# EAGLE design IN-17 logic V1.0 (EAGLE 9.6.2)
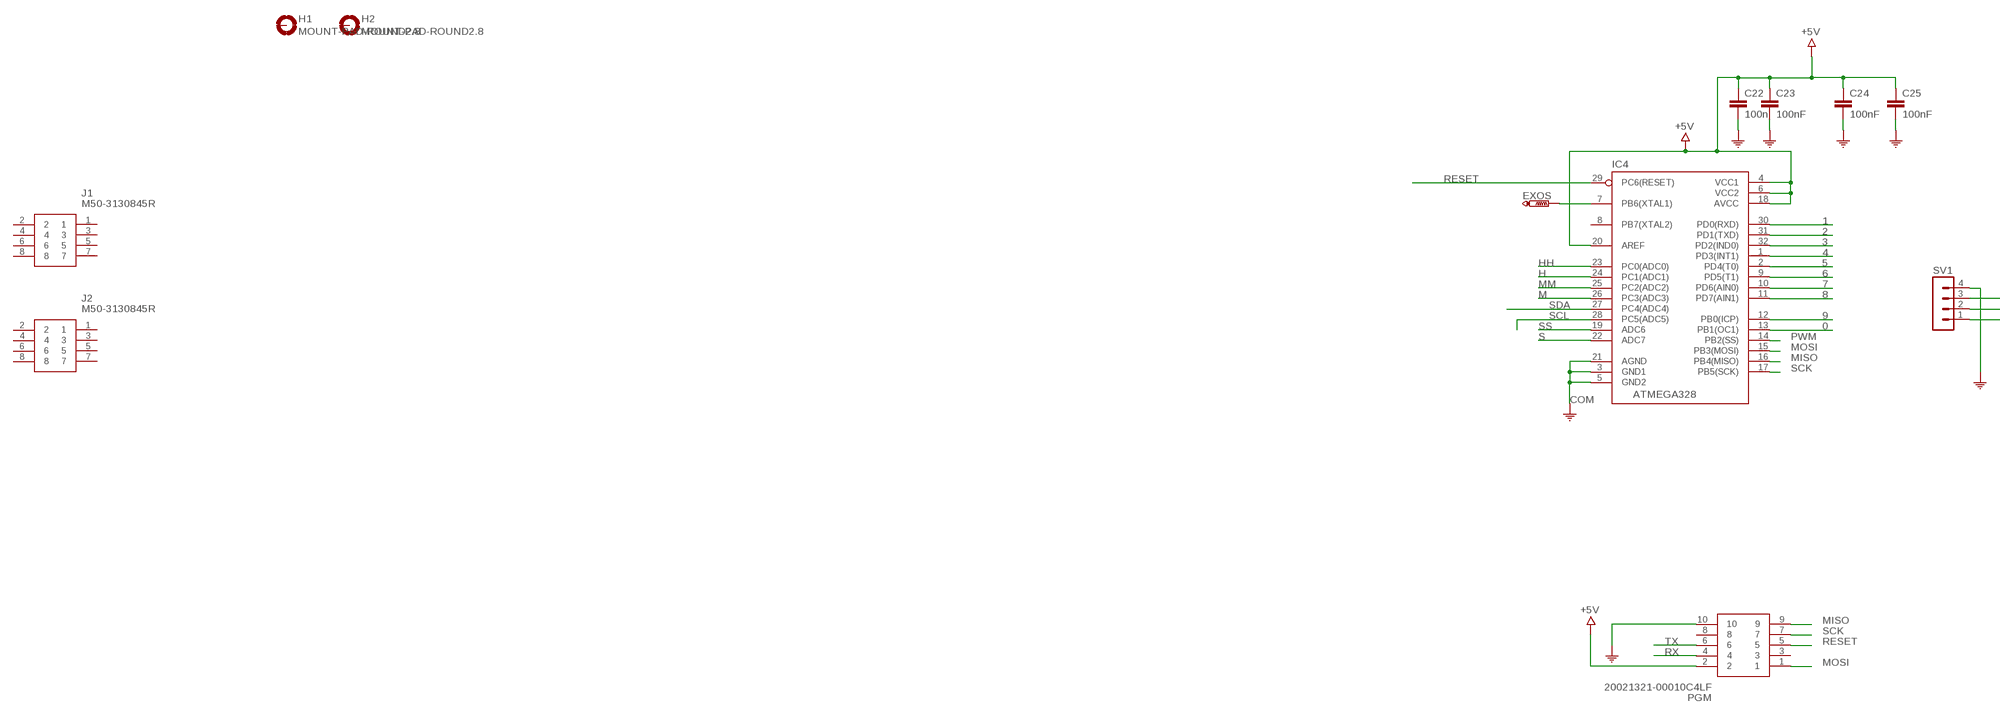
[diagram p0: schematic, sheet 1, part 1 of 2]
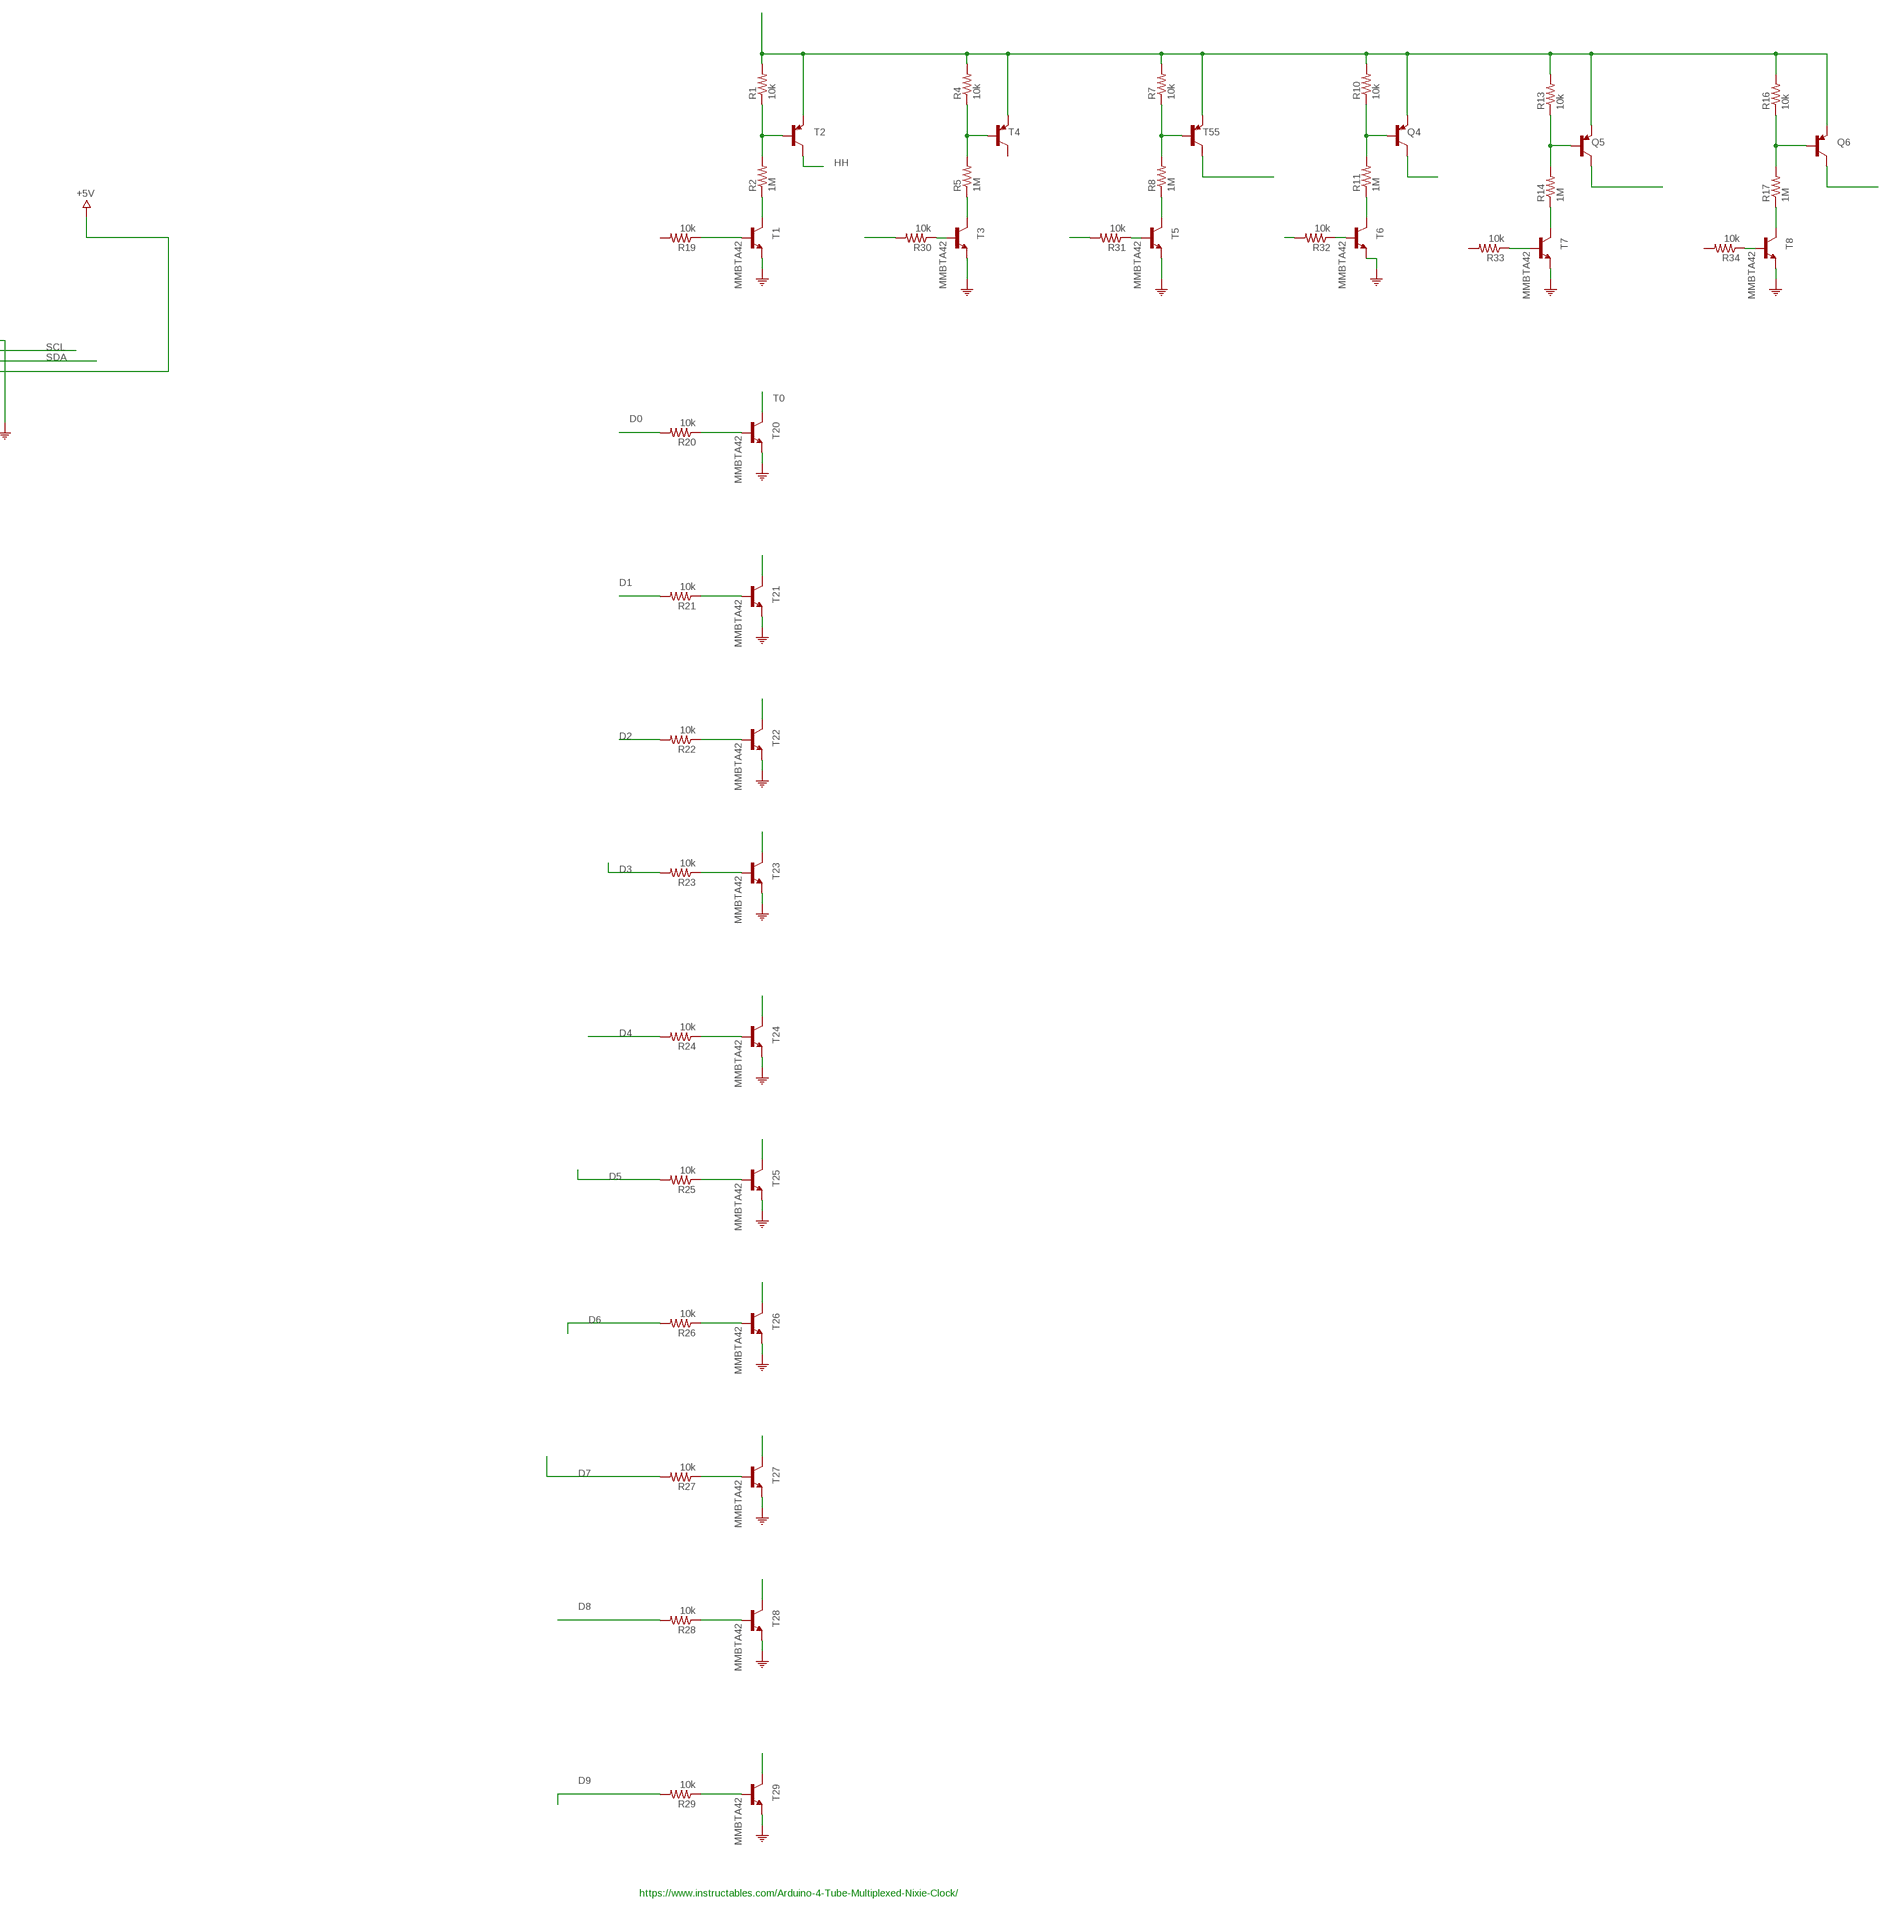
[diagram p1: schematic, sheet 1, part 2 of 2]

## Parts
C22  100n  C-EUC0805  [C0805]
C23  100nF  C-EUC0805  [C0805]
C24  100nF  C-EUC0805  [C0805]
C25  100nF  C-EUC0805  [C0805]
EXOS  PTR1TP09R  [TP09R]
H1  MOUNT-PAD-ROUND2.8  [2,8-PAD]
H2  MOUNT-PAD-ROUND2.8  [2,8-PAD]
IC4  ATMEGA328  ATMEGA168-20AU  [QFP032]
J1  M50-3130845R  [M503130845R]
J2  M50-3130845R  [M503130845R]
PGM  20021321-00010C4LF  [2002132100010C4LF]
Q4  TRANSISTOR_BJT_PNP-SOT-23-BCE  [SOT-23]
Q5  TRANSISTOR_BJT_PNP-SOT-23-BCE  [SOT-23]
Q6  TRANSISTOR_BJT_PNP-SOT-23-BCE  [SOT-23]
R1  10k  R-US_R0805  [R0805]
R2  1M  R-US_R0805  [R0805]
R4  10k  R-US_R0805  [R0805]
R5  1M  R-US_R0805  [R0805]
R7  10k  R-US_R0805  [R0805]
R8  1M  R-US_R0805  [R0805]
R10  10k  R-US_R0805  [R0805]
R11  1M  R-US_R0805  [R0805]
R13  10k  R-US_R0805  [R0805]
R14  1M  R-US_R0805  [R0805]
R16  10k  R-US_R0805  [R0805]
R17  1M  R-US_R0805  [R0805]
R19  10k  R-US_R0805  [R0805]
R20  10k  R-US_R0805  [R0805]
R21  10k  R-US_R0805  [R0805]
R22  10k  R-US_R0805  [R0805]
R23  10k  R-US_R0805  [R0805]
R24  10k  R-US_R0805  [R0805]
R25  10k  R-US_R0805  [R0805]
R26  10k  R-US_R0805  [R0805]
R27  10k  R-US_R0805  [R0805]
R28  10k  R-US_R0805  [R0805]
R29  10k  R-US_R0805  [R0805]
R30  10k  R-US_R0805  [R0805]
R31  10k  R-US_R0805  [R0805]
R32  10k  R-US_R0805  [R0805]
R33  10k  R-US_R0805  [R0805]
R34  10k  R-US_R0805  [R0805]
SV1  MA04-1  [MA04-1]
T1  MMBTA42  BC846  [SOT23]
T2  TRANSISTOR_BJT_PNP-SOT-23-BCE  [SOT-23]
T3  MMBTA42  BC846  [SOT23]
T4  TRANSISTOR_BJT_PNP-SOT-23-BCE  [SOT-23]
T5  MMBTA42  BC846  [SOT23]
T6  MMBTA42  BC846  [SOT23]
T7  MMBTA42  BC846  [SOT23]
T8  MMBTA42  BC846  [SOT23]
T20  MMBTA42  BC846  [SOT23]
T21  MMBTA42  BC846  [SOT23]
T22  MMBTA42  BC846  [SOT23]
T23  MMBTA42  BC846  [SOT23]
T24  MMBTA42  BC846  [SOT23]
T25  MMBTA42  BC846  [SOT23]
T26  MMBTA42  BC846  [SOT23]
T27  MMBTA42  BC846  [SOT23]
T28  MMBTA42  BC846  [SOT23]
T29  MMBTA42  BC846  [SOT23]
T55  TRANSISTOR_BJT_PNP-SOT-23-BCE  [SOT-23]

## Nets
0: IC4.13(PB1(OC1))
1: IC4.30(PD0(RXD))
2: IC4.31(PD1(TXD))
3: IC4.32(PD2(IND0))
4: IC4.1(PD3(INT1))
5: IC4.2(PD4(T0))
6: IC4.9(PD5(T1))
7: IC4.10(PD6(AIN0))
8: IC4.11(PD7(AIN1))
9: IC4.12(PB0(ICP))
+5V [pwr]: C22.1 C23.1 C24.1 C25.1 IC4.4(VCC1) IC4.6(VCC2) IC4.18(AVCC) IC4.20(AREF) PGM.2 SV1.1
COM: C22.2 C23.2 C24.2 C25.2 IC4.3(GND1) IC4.5(GND2) IC4.21(AGND) PGM.10 SV1.4 T1.2(E) T3.2(E) T5.2(E) T6.2(E) T7.2(E) T8.2(E) T20.2(E) T21.2(E) T22.2(E) T23.2(E) T24.2(E) T25.2(E) T26.2(E) T27.2(E) T28.2(E) T29.2(E)
D0: R20.2
D1: R21.2
D2: R22.2
D3: R23.2
D4: R24.2
D5: R25.2
D6: R26.2
D7: R27.2
D8: R28.2
D9: R29.2
H: IC4.24(PC1(ADC1))
HH: IC4.23(PC0(ADC0)) T2.2(C)
M: IC4.26(PC3(ADC3))
MISO: IC4.16(PB4(MISO)) PGM.9
MM: IC4.25(PC2(ADC2))
MOSI: IC4.15(PB3(MOSI)) PGM.1
N$1: R1.1 R2.2 T2.1(B)
N$2: R2.1 T1.3(C)
N$3: Q6.2(C)
N$4: Q4.3(E) Q5.3(E) Q6.3(E) R1.2 R4.2 R7.2 R10.2 R13.2 R16.2 T2.3(E) T4.3(E) T55.3(E)
N$5: EXOS.TP IC4.7(PB6(XTAL1))
N$6: R19.1 T1.1(B)
N$8: R20.1 T20.1(B)
N$9: T21.3(C)
N$10: R21.1 T21.1(B)
N$11: T22.3(C)
N$12: R22.1 T22.1(B)
N$13: T23.3(C)
N$14: R23.1 T23.1(B)
N$15: T24.3(C)
N$16: R24.1 T24.1(B)
N$17: T25.3(C)
N$18: R25.1 T25.1(B)
N$19: T26.3(C)
N$20: R26.1 T26.1(B)
N$21: T27.3(C)
N$22: R27.1 T27.1(B)
N$23: T28.3(C)
N$24: R28.1 T28.1(B)
N$25: T29.3(C)
N$26: R29.1 T29.1(B)
N$27: Q5.2(C)
N$28: Q4.2(C)
N$29: T55.2(C)
N$31: Q5.1(B) R13.1 R14.2
N$32: Q4.1(B) R10.1 R11.2
N$33: R7.1 R8.2 T55.1(B)
N$34: R4.1 R5.2 T4.1(B)
N$35: R5.1 T3.3(C)
N$36: R8.1 T5.3(C)
N$37: R11.1 T6.3(C)
N$38: R14.1 T7.3(C)
N$39: Q6.1(B) R16.1 R17.2
N$41: R17.1 T8.3(C)
N$42: R34.1 T8.1(B)
N$43: R33.1 T7.1(B)
N$44: R32.1 T6.1(B)
N$45: R31.1 T5.1(B)
N$46: R30.1 T3.1(B)
N$47: R30.2
N$48: R31.2
N$49: R32.2
PWM: IC4.14(PB2(SS))
RESET: IC4.29(PC6(RESET)) PGM.5
RX: PGM.4
S: IC4.22(ADC7)
SCK: IC4.17(PB5(SCK)) PGM.7
SCL: IC4.28(PC5(ADC5)) SV1.3
SDA: IC4.27(PC4(ADC4)) SV1.2
SS: IC4.19(ADC6)
T0: T20.3(C)
TX: PGM.6
Unconnected: H1.B2,8(MOUNT) H2.B2,8(MOUNT) IC4.8(PB7(XTAL2)) J1.1 J1.2 J1.3 J1.4 J1.5 J1.6 J1.7 J1.8 J2.1 J2.2 J2.3 J2.4 J2.5 J2.6 J2.7 J2.8 PGM.3 PGM.8 R19.2 R33.2 R34.2 T4.2(C)

## Notes on the sheet
- https://www.instructables.com/Arduino-4-Tube-Multiplexed-Nixie-Clock/

## Library data of the parts
C22-C25 = rcl:C-EU: CAPACITOR, European symbol; SPICEPREFIX: C
EXOS = testpad:PTR1: TEST PIN
H1 H2 = holes:MOUNT-PAD-ROUND: MOUNTING PAD, round
IC4 = MySMD:ATMEGA168-20AU; PU: 1.40
J1 J2 = SamacSys_Parts:M50-3130845R: Headers & Wire Housings 8 WAY SIL L/P D/E SMT SKT T&R Source: Datasheet <https://cdn.harwin.com/pdfs/M50-313.pdf>; DESCRIPTION: Headers & Wire Housings 8 WAY SIL L/P D/E SMT SKT T&R; HEIGHT: 2.15mm; MANUFACTURER_NAME: Harwin; MANUFACTURER_PART_NUMBER: M50-3130845R; MOUSER_PART_NUMBER: 855-M50-3130845R; MOUSER_PRICE-STOCK: https://www.mouser.co.uk/ProductDetail/Harwin/M50-3130845R?qs=%252BdQmOuGyFcEPvrxbacvJZw%3D%3D
PGM = SamacSys_Parts:20021321-00010C4LF: Headers & Wire Housings 1.27x1.27mm BTB, Hdr Recept, SMT, 10 Pos Source: Datasheet <https://componentsearchengine.com/Datasheets/1/20021321-00010C4LF.pdf>; DESCRIPTION: Headers & Wire Housings 1.27x1.27mm BTB, Hdr Recept, SMT, 10 Pos; HEIGHT: 4.75mm; MANUFACTURER_NAME: Amphenol; MANUFACTURER_PART_NUMBER: 20021321-00010C4LF; MOUSER_PART_NUMBER: 649-202132100010C4LF; MOUSER_PRICE-STOCK: https://www.mouser.com/Search/Refine.aspx?Keyword=649-202132100010C4LF
Q4-Q6 T2 T4 T55 = dp_devices:TRANSISTOR_BJT_PNP: Most commonly used is SOT23-BEC
R1 R2 R4 R5 R7 R8 R10 R11 R13 R14 R16 R17 R19-R34 = adafruit:R-US_: RESISTOR, American symbol
SV1 = con-lstb:MA04-1: PIN HEADER; OC_FARNELL: unknown; OC_NEWARK: unknown
T1 T3 T5-T8 T20-T29 = transistor:BC846: NPN TRANSISTOR

## Net classes
1 pwr: width 0.254 mm, clearance 0.356 mm

## Board
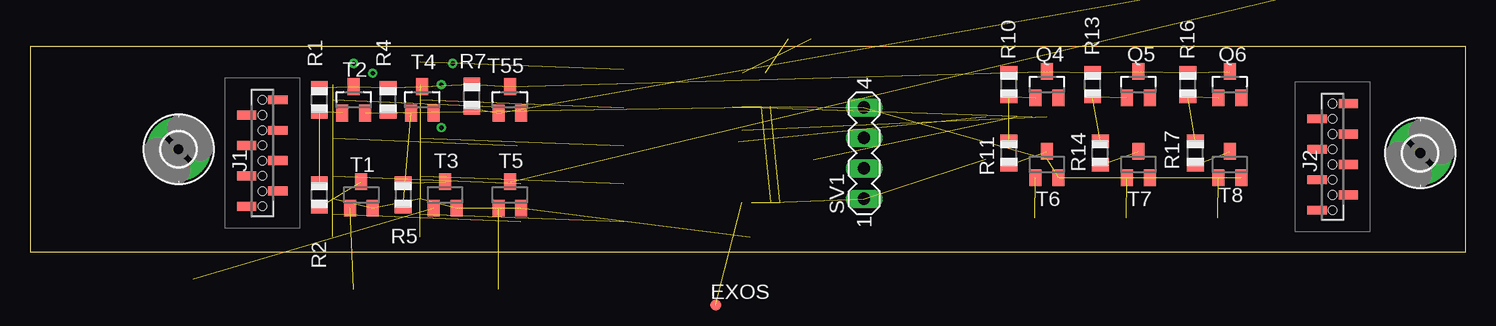
[diagram p2: board, top side]
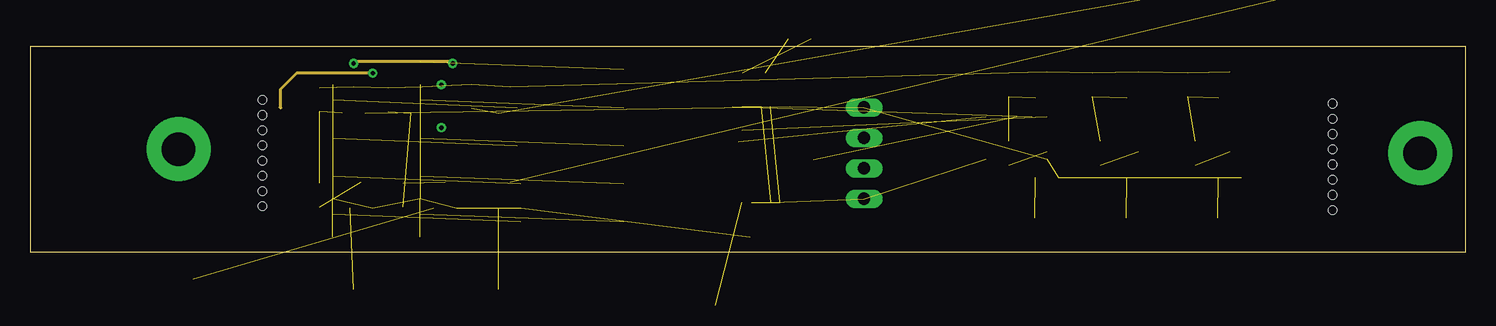
[diagram p3: board, inner layer Route2]
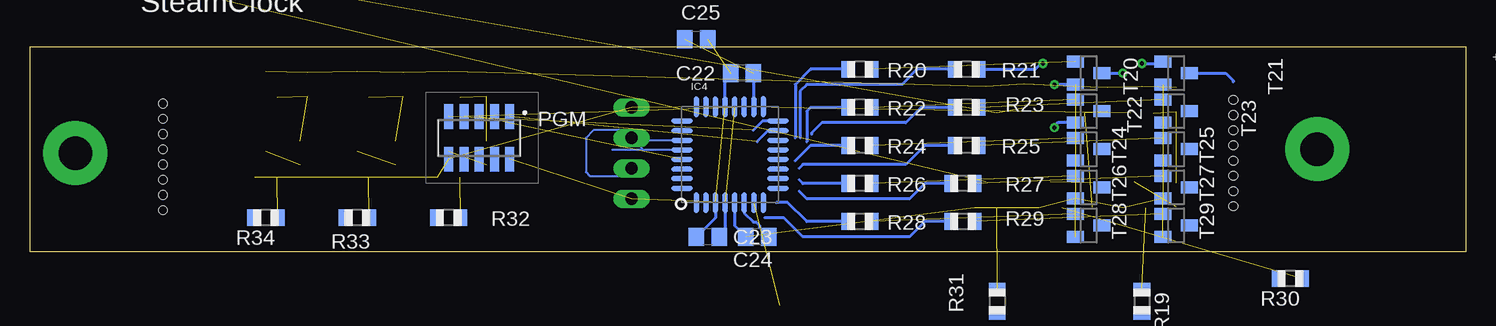
[diagram p4: board, bottom side, seen from below]

Size 119.68 x 17.13 mm. Coordinates in mm from the lower left corner, seen from the top.
Outline: 0,0 119.68,0 119.68,17.13 0,17.13 0,0
Copper layers (1+2*15+16): Top 0.035mm / dielectric 1.5mm / Route2 0.035mm / dielectric 0.15mm / GND 0.035mm / dielectric 0.2mm / Bottom 0.035mm
Design rules "default *": minimum track width 6mil, minimum drill 0.35mm, track to track 6mil, track to pad 6mil, pad to pad 6mil, via to via 6mil, smd to smd 6mil, copper to edge 40mil, drill to drill 6mil, minimum pad ring 10mil, minimum via ring 8mil, stop-mask expansion 4mil, vias tented up to drill 0mil, thermal gap 10mil

### Footprints (pad centres in the part's own frame; a part is rotated, then mirrored left to right if it is on the bottom)
C0805 = smd 1.3 x 1.5: 1 -0.95,0; 2 0.95,0
TP09R = smd 0.9 x 0.9: TP 0,0
2,8-PAD = drill 2.8 pad 5.334: B2,8 0,0
QFP032 = smd 0.432 x 1.778: 1 0,0; 2 0.8,0; 3 1.599,0; 4 2.399,0; 5 3.199,0; 6 3.998,0; 7 4.798,0; 8 5.598,0; 17 5.588,8.001; 18 4.798,7.997; 19 3.998,7.997; 20 3.199,7.997; 21 2.399,7.997; 22 1.599,7.997; 23 0.799,7.997; 24 0,7.997 | smd 1.778 x 0.432: 9 6.807,1.194; 10 6.807,2.007; 11 6.807,2.794; 12 6.807,3.607; 13 6.807,4.394; 14 6.807,5.182; 15 6.807,5.994; 16 6.816,6.803; 25 -1.194,6.807; 26 -1.194,5.994; 27 -1.194,5.182; 28 -1.194,4.394; 29 -1.194,3.607; 30 -1.194,2.794; 31 -1.194,2.007; 32 -1.194,1.194
M503130845R = smd 0.74 x 1.6: 1 -4.445,1.3; 2 -3.175,-1.3; 3 -1.905,1.3; 4 -0.635,-1.3; 5 0.635,1.3; 6 1.905,-1.3; 7 3.175,1.3; 8 4.445,-1.3 | hole 0.7: -4.445,0; -3.175,0; -1.905,0; -0.635,0; 0.635,0; 1.905,0; 3.175,0; 4.445,0
2002132100010C4LF = smd 0.76 x 2.05: 1 2.54,1.775; 2 2.54,-1.775; 3 1.27,1.775; 4 1.27,-1.775; 5 0,1.775; 6 0,-1.775; 7 -1.27,1.775; 8 -1.27,-1.775; 9 -2.54,1.775; 10 -2.54,-1.775
SOT-23 = smd 1 x 1.4: 1 -0.95,-1.1; 2 0.95,-1.1; 3 0,1.1
R0805 = smd 1.1 x 1.4: 1 -1,0; 2 1,0
MA04-1 = drill 1.016 long: 1 -3.81,0; 2 -1.27,0; 3 1.27,0; 4 3.81,0
SOT23 = smd 1 x 1.4: 1 -0.95,-1.1; 2 0.95,-1.1; 3 0,1.1

### Placement (x,y rotation side)
C22  60.32,14.92 180 bottom
C23  63.18,1.27 180 bottom
C24  59.05,1.27 180 bottom
C25  64.14,17.78 0 bottom
EXOS  57.15,-4.45 0 top  (outside the outline)
H1  12.38,8.57 0 top
H2  115.89,8.25 0 top
IC4  64.14,4.13 0 bottom
J1  19.37,8.25 90 top
J2  108.59,7.94 90 top
PGM  82.23,9.52 0 bottom
Q4  84.77,13.97 0 top
Q5  92.39,13.97 0 top
Q6  100.01,13.97 0 top
R1  24.13,12.7 90 top
R2  24.13,4.76 90 top
R4  29.84,12.7 90 top
R5  31.11,4.76 270 top
R7  36.83,13.02 90 top
R8  142.88,30.16 0 top  (outside the outline)
R10  81.6,13.97 90 top
R11  81.6,8.25 90 top
R13  88.58,13.97 90 top
R14  89.22,8.25 90 top
R16  96.52,13.97 90 top
R17  97.16,8.25 90 top
R19  26.99,-4.13 270 bottom  (outside the outline)
R20  50.48,15.24 180 bottom
R21  41.59,15.24 180 bottom
R22  50.48,12.06 180 bottom
R23  41.59,12.06 180 bottom
R24  50.48,8.89 180 bottom
R25  41.59,8.89 180 bottom
R26  50.48,5.71 180 bottom
R27  41.91,5.71 180 bottom
R28  50.48,2.54 180 bottom
R29  41.91,2.54 180 bottom
R30  14.61,-2.22 180 bottom
R31  39.05,-4.13 270 bottom  (outside the outline)
R32  84.77,2.86 180 bottom
R33  92.39,2.86 180 bottom
R34  100.01,2.86 180 bottom
SV1  69.53,8.25 90 top
T1  27.62,4.76 0 top
T2  26.99,12.7 0 top
T3  34.61,4.76 0 top
T4  32.7,12.7 0 top
T5  40,4.76 0 top
T6  84.77,7.3 0 top
T7  92.39,7.3 0 top
T8  100.01,7.3 0 top
T20  31.43,14.92 270 bottom
T21  24.13,14.92 270 bottom
T22  31.43,11.75 270 bottom
T23  24.13,11.75 270 bottom
T24  31.43,8.57 270 bottom
T25  24.13,8.57 270 bottom
T26  31.43,5.4 270 bottom
T27  24.13,5.4 270 bottom
T28  31.43,2.22 270 bottom
T29  24.13,2.22 270 bottom
T55  40,12.7 0 top

### Tracks (layer width: path | path; a pad name or v marks a point on that pad's centre or on a via)
+5V  (6 unrouted)
  Bottom 0.254: IC4.18 59.34,14.88 C22.1 | IC4.4 61.74,2.23 61.73,2.22 61.73,1.77 C23.1 | C24.1 58.87,2.04 58.87,2.22 59.15,2.5 59.37,2.5 60.14,3.27 IC4.6
COM  (via drill 0.35)  (21 unrouted)
  Bottom 0.254: IC4.21 61.74,14.46 C22.2 | IC4.3 62.55,2.85 C23.2 | IC4.5 60.94,2.2 C24.2 | T20.2 v34.29,13.97 | T22.2 33.97,10.8 34.29,10.48 v34.29,10.37
D0
  Bottom 0.254: R20.2 54.61,15.24 55.88,13.97 55.88,9.52
D1
  Bottom 0.254: R21.2 45.72,15.24 46.99,13.97 54.93,13.97 55.47,13.42 55.47,9.52
D2
  Bottom 0.254: R22.2 54.61,12.06 54.93,11.75 54.93,9.21
D3
  Bottom 0.254: R23.2 45.4,12.06 46.67,10.8 53.66,10.8 54.52,9.93 54.52,9.84
D4
  Bottom 0.254: 55.88,7.62 54.61,8.89 R24.2
D5
  Bottom 0.254: R25.2 45.08,8.89 46.67,7.3 55.24,7.3 55.56,6.98
D6
  Bottom 0.254: 55.56,6.03 55.24,5.71 R26.2
D7
  Bottom 0.254: R27.2 45.08,5.71 46.35,4.45 54.93,4.45 55.56,5.08
D8
  Bottom 0.254: 57.47,4.13 56.51,4.13 54.93,2.54 R28.2
D9
  Bottom 0.254: R29.2 45.08,2.54 46.35,1.27 55.24,1.27 56.83,2.86 58.42,2.86
HH  (1 unrouted)
MISO  (1 unrouted)
  Bottom 0.254: IC4.16 58.6,10.93 59.37,10.16
MOSI  (1 unrouted)
  Bottom 0.254: IC4.15 58.14,10.12 59.05,9.21
N$1  (2 unrouted)
N$2  (1 unrouted)
N$4  (11 unrouted)
N$5  (1 unrouted)
N$6  (1 unrouted)
N$8  (1 unrouted)
N$9
  Bottom 0.254: 19.37,14.19 19.37,14.29 20,14.92 T21.3
N$10  (via drill 0.35)
  Route2 0.254: v35.24,15.74 35.11,15.88 26.99,15.88 v26.99,15.74
  Bottom 0.254: R21.1 35.88,15.24 35.24,15.88 v35.24,15.74 | v26.99,15.74 25.36,15.74 T21.1
N$12  (1 unrouted)
N$14  (1 unrouted)
N$16  (1 unrouted)
N$18  (1 unrouted)
N$20  (1 unrouted)
N$22  (1 unrouted)
N$24  (1 unrouted)
N$26  (1 unrouted)
N$31  (2 unrouted)
N$32  (2 unrouted)
N$33  (2 unrouted)
N$34  (2 unrouted)
N$35  (1 unrouted)
N$36  (1 unrouted)
N$37  (1 unrouted)
N$38  (1 unrouted)
N$39  (2 unrouted)
N$41  (1 unrouted)
N$42  (1 unrouted)
N$43  (1 unrouted)
N$44  (1 unrouted)
N$45  (1 unrouted)
N$46  (1 unrouted)
RESET  (1 unrouted)
SCK  (1 unrouted)
SCL
  Bottom 0.152: 71.12,8.52 IC4.28 68.53,8.52 SV1.3
SDA
  Bottom 0.152: IC4.27 68.05,9.31 68.9,10.16 72.71,10.16 73.34,9.52 73.34,6.67 73.03,6.35 70.17,6.35 SV1.2
T0  (via drill 0.35)
  Route2 0.254: v28.57,14.92 22.23,14.92 20.86,13.56 20.86,12.08 20.84,12.06 20.9,12.01
  Bottom 0.254: T20.3 v28.57,14.92

### Text on the board
bNames: SteamClock | +5